# Altium schematic sheet [5] - Z7010 POWER INF.SchDoc: Z7010 POWER INF
size B; Organization: Altium Limited; Address1: L3, 12a Rodborough Rd; Address2: Frenchs Forest; Address3: NSW; Address4: Australia 2086; DocumentNumber: 5; SheetNumber: 5; SheetTotal: 16
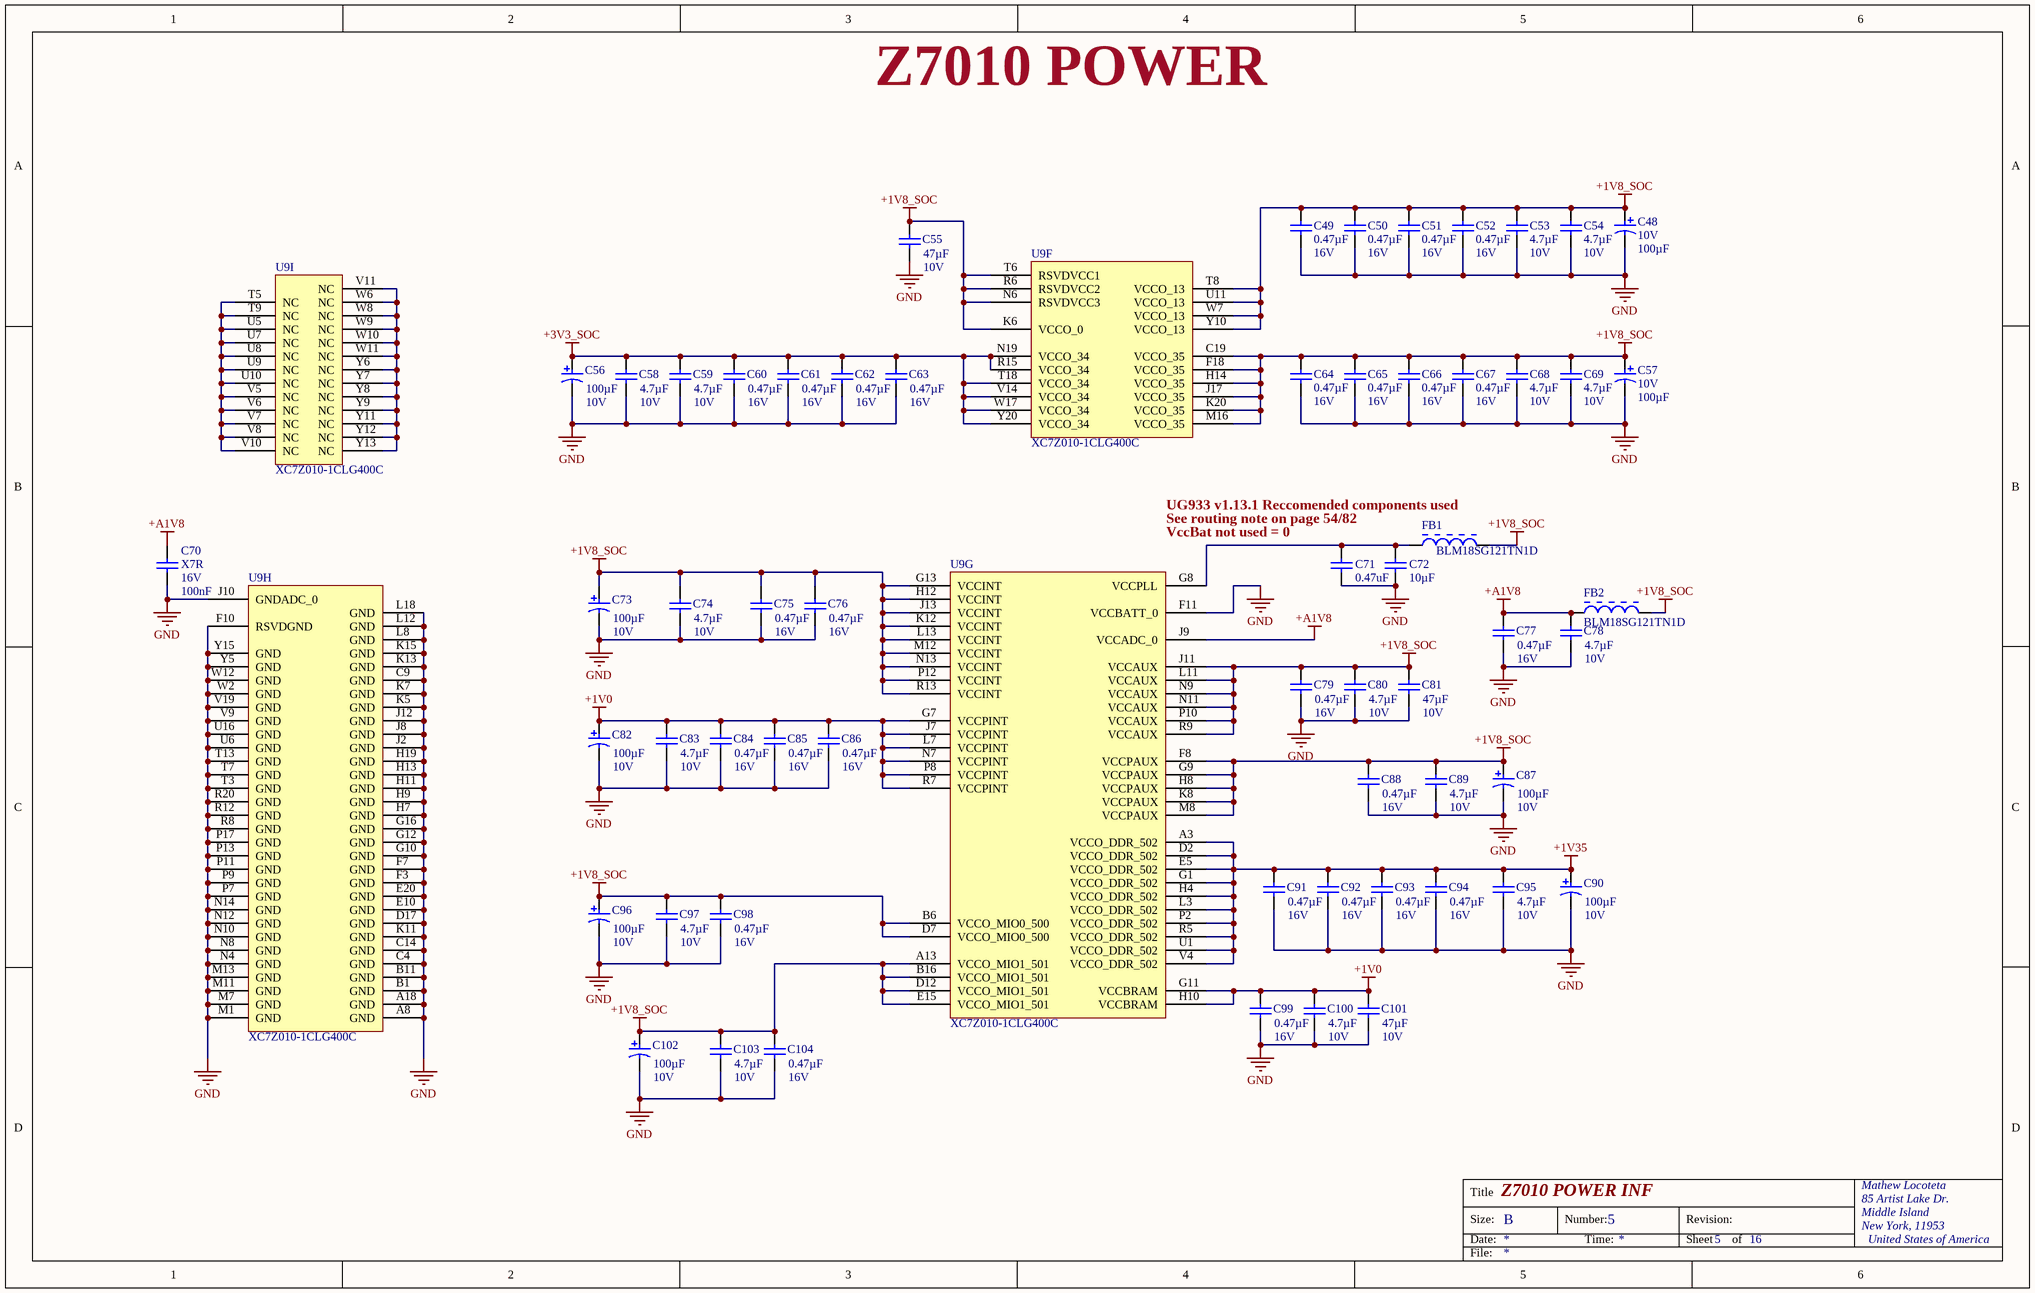
[diagram p0: [5] - Z7010 POWER INF.SchDoc]

## Parts
C48  Voltage: 10V  Capacitance: 100µF  [AVX-C2312_L]  (hidden comment: TPSC107K010R0075)
C49  value 0.47µF  Voltage: 16V  [CAPC1608X90X35NL10T15]  (hidden comment: GRM188R71C474KA88D)
C50  value 0.47µF  Voltage: 16V  [CAPC1608X90X35NL10T15]  (hidden comment: GRM188R71C474KA88D)
C51  value 0.47µF  Voltage: 16V  [CAPC1608X90X35NL10T15]  (hidden comment: GRM188R71C474KA88D)
C52  value 0.47µF  Voltage: 16V  [CAPC1608X90X35NL10T15]  (hidden comment: GRM188R71C474KA88D)
C53  value 4.7µF  Voltage: 10V  [CAPC2013X152X50ML20T25]  (hidden comment: 0805YC475KAT2A)
C54  value 4.7µF  Voltage: 10V  [CAPC2013X152X50ML20T25]  (hidden comment: 0805YC475KAT2A)
C55  Rated Voltage: 10V  Capacitance: 47µF  [MURA-1210_H_2.7_L]  (hidden comment: GRM32ER71A476ME15L)
C56  Voltage: 10V  Capacitance: 100µF  [AVX-C2312_L]  (hidden comment: TPSC107K010R0075)
C57  Voltage: 10V  Capacitance: 100µF  [AVX-C2312_L]  (hidden comment: TPSC107K010R0075)
C58  value 4.7µF  Voltage: 10V  [CAPC2013X152X50ML20T25]  (hidden comment: 0805YC475KAT2A)
C59  value 4.7µF  Voltage: 10V  [CAPC2013X152X50ML20T25]  (hidden comment: 0805YC475KAT2A)
C60  value 0.47µF  Voltage: 16V  [CAPC1608X90X35NL10T15]  (hidden comment: GRM188R71C474KA88D)
C61  value 0.47µF  Voltage: 16V  [CAPC1608X90X35NL10T15]  (hidden comment: GRM188R71C474KA88D)
C62  value 0.47µF  Voltage: 16V  [CAPC1608X90X35NL10T15]  (hidden comment: GRM188R71C474KA88D)
C63  value 0.47µF  Voltage: 16V  [CAPC1608X90X35NL10T15]  (hidden comment: GRM188R71C474KA88D)
C64  value 0.47µF  Voltage: 16V  [CAPC1608X90X35NL10T15]  (hidden comment: GRM188R71C474KA88D)
C65  value 0.47µF  Voltage: 16V  [CAPC1608X90X35NL10T15]  (hidden comment: GRM188R71C474KA88D)
C66  value 0.47µF  Voltage: 16V  [CAPC1608X90X35NL10T15]  (hidden comment: GRM188R71C474KA88D)
C67  value 0.47µF  Voltage: 16V  [CAPC1608X90X35NL10T15]  (hidden comment: GRM188R71C474KA88D)
C68  value 4.7µF  Voltage: 10V  [CAPC2013X152X50ML20T25]  (hidden comment: 0805YC475KAT2A)
C69  value 4.7µF  Voltage: 10V  [CAPC2013X152X50ML20T25]  (hidden comment: 0805YC475KAT2A)
C70  Dielectric: X7R  Voltage Rating: 16V  Capacitance: 100nF  (hidden comment: 100nF 0402 16V)
C71  value 0.47uF  [CAPC1005X55X25LL05T10]  (hidden comment: GRM155R60J474KE19D)
C72  value 10µF  [CAPC1608X90X35LL10T15]  (hidden comment: GRM188R60G106ME47D)
C73  Voltage: 10V  Capacitance: 100µF  [AVX-C2312_L]  (hidden comment: TPSC107K010R0075)
C74  value 4.7µF  Voltage: 10V  [CAPC2013X152X50ML20T25]  (hidden comment: 0805YC475KAT2A)
C75  value 0.47µF  Voltage: 16V  [CAPC1608X90X35NL10T15]  (hidden comment: GRM188R71C474KA88D)
C76  value 0.47µF  Voltage: 16V  [CAPC1608X90X35NL10T15]  (hidden comment: GRM188R71C474KA88D)
C77  value 0.47µF  Voltage: 16V  [CAPC1608X90X35NL10T15]  (hidden comment: GRM188R71C474KA88D)
C78  value 4.7µF  Voltage: 10V  [CAPC2013X152X50ML20T25]  (hidden comment: 0805YC475KAT2A)
C79  value 0.47µF  Voltage: 16V  [CAPC1608X90X35NL10T15]  (hidden comment: GRM188R71C474KA88D)
C80  value 4.7µF  Voltage: 10V  [CAPC2013X152X50ML20T25]  (hidden comment: 0805YC475KAT2A)
C81  Rated Voltage: 10V  Capacitance: 47µF  [MURA-1210_H_2.7_L]  (hidden comment: GRM32ER71A476ME15L)
C82  Voltage: 10V  Capacitance: 100µF  [AVX-C2312_L]  (hidden comment: TPSC107K010R0075)
C83  value 4.7µF  Voltage: 10V  [CAPC2013X152X50ML20T25]  (hidden comment: 0805YC475KAT2A)
C84  value 0.47µF  Voltage: 16V  [CAPC1608X90X35NL10T15]  (hidden comment: GRM188R71C474KA88D)
C85  value 0.47µF  Voltage: 16V  [CAPC1608X90X35NL10T15]  (hidden comment: GRM188R71C474KA88D)
C86  value 0.47µF  Voltage: 16V  [CAPC1608X90X35NL10T15]  (hidden comment: GRM188R71C474KA88D)
C87  Voltage: 10V  Capacitance: 100µF  [AVX-C2312_L]  (hidden comment: TPSC107K010R0075)
C88  value 0.47µF  Voltage: 16V  [CAPC1608X90X35NL10T15]  (hidden comment: GRM188R71C474KA88D)
C89  value 4.7µF  Voltage: 10V  [CAPC2013X152X50ML20T25]  (hidden comment: 0805YC475KAT2A)
C90  Voltage: 10V  Capacitance: 100µF  [AVX-C2312_L]  (hidden comment: TPSC107K010R0075)
C91  value 0.47µF  Voltage: 16V  [CAPC1608X90X35NL10T15]  (hidden comment: GRM188R71C474KA88D)
C92  value 0.47µF  Voltage: 16V  [CAPC1608X90X35NL10T15]  (hidden comment: GRM188R71C474KA88D)
C93  value 0.47µF  Voltage: 16V  [CAPC1608X90X35NL10T15]  (hidden comment: GRM188R71C474KA88D)
C94  value 0.47µF  Voltage: 16V  [CAPC1608X90X35NL10T15]  (hidden comment: GRM188R71C474KA88D)
C95  value 4.7µF  Voltage: 10V  [CAPC2013X152X50ML20T25]  (hidden comment: 0805YC475KAT2A)
C96  Voltage: 10V  Capacitance: 100µF  [AVX-C2312_L]  (hidden comment: TPSC107K010R0075)
C97  value 4.7µF  Voltage: 10V  [CAPC2013X152X50ML20T25]  (hidden comment: 0805YC475KAT2A)
C98  value 0.47µF  Voltage: 16V  [CAPC1608X90X35NL10T15]  (hidden comment: GRM188R71C474KA88D)
C99  value 0.47µF  Voltage: 16V  [CAPC1608X90X35NL10T15]  (hidden comment: GRM188R71C474KA88D)
C100  value 4.7µF  Voltage: 10V  [CAPC2013X152X50ML20T25]  (hidden comment: 0805YC475KAT2A)
C101  Rated Voltage: 10V  Capacitance: 47µF  [MURA-1210_H_2.7_L]  (hidden comment: GRM32ER71A476ME15L)
C102  Voltage: 10V  Capacitance: 100µF  [AVX-C2312_L]  (hidden comment: TPSC107K010R0075)
C103  value 4.7µF  Voltage: 10V  [CAPC2013X152X50ML20T25]  (hidden comment: 0805YC475KAT2A)
C104  value 0.47µF  Voltage: 16V  [CAPC1608X90X35NL10T15]  (hidden comment: GRM188R71C474KA88D)
FB1  BLM18SG121TN1D  [MURA-BLM18SG-B40-CHIP-2_V3]
FB2  BLM18SG121TN1D  [MURA-BLM18SG-B40-CHIP-2_V3]
U9  XC7Z010-1CLG400C  [CLG400]  (parts F,G,H,I of 9)

## Nets
+1V0: C82.1 C83.2 C84.2 C85.2 C86.2 C99.2 C100.2 C101.2 U9.G7(VCCPINT) U9.G11(VCCBRAM) U9.H10(VCCBRAM) U9.J7(VCCPINT) U9.L7(VCCPINT) U9.N7(VCCPINT) U9.P8(VCCPINT) U9.R7(VCCPINT)
+1V8_SOC: C48.1 C49.2 C50.2 C51.2 C52.2 C53.2 C54.2 C55.2 C57.1 C64.2 C65.2 C66.2 C67.2 C68.2 C69.2 C73.1 C74.2 C75.2 C76.2 C79.2 C80.2 C81.2 C87.1 C88.2 C89.2 C96.1 C97.2 C98.2 C102.1 C103.2 C104.2 FB1.2 FB2.2 U9.A13(VCCO_MIO1_501) U9.B6(VCCO_MIO0_500) U9.B16(VCCO_MIO1_501) U9.C19(VCCO_35) U9.D7(VCCO_MIO0_500) U9.D12(VCCO_MIO1_501) U9.E15(VCCO_MIO1_501) U9.F8(VCCPAUX) U9.F18(VCCO_35) U9.G9(VCCPAUX) U9.G13(VCCINT) U9.H8(VCCPAUX) U9.H12(VCCINT) U9.H14(VCCO_35) U9.J11(VCCAUX) U9.J13(VCCINT) U9.J17(VCCO_35) U9.K6(VCCO_0) U9.K8(VCCPAUX) U9.K12(VCCINT) U9.K20(VCCO_35) U9.L11(VCCAUX) U9.L13(VCCINT) U9.M8(VCCPAUX) U9.M12(VCCINT) U9.M16(VCCO_35) U9.N6(RSVDVCC3) U9.N9(VCCAUX) U9.N11(VCCAUX) U9.N13(VCCINT) U9.P10(VCCAUX) U9.P12(VCCINT) U9.R6(RSVDVCC2) U9.R9(VCCAUX) U9.R13(VCCINT) U9.T6(RSVDVCC1) U9.T8(VCCO_13) U9.U11(VCCO_13) U9.W7(VCCO_13) U9.Y10(VCCO_13)
+1V35: C90.1 C91.2 C92.2 C93.2 C94.2 C95.2 U9.A3(VCCO_DDR_502) U9.D2(VCCO_DDR_502) U9.E5(VCCO_DDR_502) U9.G1(VCCO_DDR_502) U9.H4(VCCO_DDR_502) U9.L3(VCCO_DDR_502) U9.P2(VCCO_DDR_502) U9.R5(VCCO_DDR_502) U9.U1(VCCO_DDR_502) U9.V4(VCCO_DDR_502)
+3V3_SOC: C56.1 C58.2 C59.2 C60.2 C61.2 C62.2 C63.2 U9.N19(VCCO_34) U9.R15(VCCO_34) U9.T18(VCCO_34) U9.V14(VCCO_34) U9.W17(VCCO_34) U9.Y20(VCCO_34)
+A1V8: C70.2 C77.2 C78.2 FB2.1 U9.J9(VCCADC_0)
GND: C48.2 C49.1 C50.1 C51.1 C52.1 C53.1 C54.1 C55.1 C56.2 C57.2 C58.1 C59.1 C60.1 C61.1 C62.1 C63.1 C64.1 C65.1 C66.1 C67.1 C68.1 C69.1 C70.1 C71.1 C72.1 C73.2 C74.1 C75.1 C76.1 C77.1 C78.1 C79.1 C80.1 C81.1 C82.2 C83.1 C84.1 C85.1 C86.1 C87.2 C88.1 C89.1 C90.2 C91.1 C92.1 C93.1 C94.1 C95.1 C96.2 C97.1 C98.1 C99.1 C100.1 C101.1 C102.2 C103.1 C104.1 U9.A8(GND) U9.A18(GND) U9.B1(GND) U9.B11(GND) U9.C4(GND) U9.C9(GND) U9.C14(GND) U9.D17(GND) U9.E10(GND) U9.E20(GND) U9.F3(GND) U9.F7(GND) U9.F10(RSVDGND) U9.F11(VCCBATT_0) U9.G10(GND) U9.G12(GND) U9.G16(GND) U9.H7(GND) U9.H9(GND) U9.H11(GND) U9.H13(GND) U9.H19(GND) U9.J2(GND) U9.J8(GND) U9.J10(GNDADC_0) U9.J12(GND) U9.K5(GND) U9.K7(GND) U9.K11(GND) U9.K13(GND) U9.K15(GND) U9.L8(GND) U9.L12(GND) U9.L18(GND) U9.M1(GND) U9.M7(GND) U9.M11(GND) U9.M13(GND) U9.N4(GND) U9.N8(GND) U9.N10(GND) U9.N12(GND) U9.N14(GND) U9.P7(GND) U9.P9(GND) U9.P11(GND) U9.P13(GND) U9.P17(GND) U9.R8(GND) U9.R12(GND) U9.R20(GND) U9.T3(GND) U9.T7(GND) U9.T13(GND) U9.U6(GND) U9.U16(GND) U9.V9(GND) U9.V19(GND) U9.W2(GND) U9.W12(GND) U9.Y5(GND) U9.Y15(GND)
NetC71_2: C71.2 C72.2 FB1.1 U9.G8(VCCPLL)
NetU9_T5: U9.T5(NC) U9.T9(NC) U9.U5(NC) U9.U7(NC) U9.U8(NC) U9.U9(NC) U9.U10(NC) U9.V5(NC) U9.V6(NC) U9.V7(NC) U9.V8(NC) U9.V10(NC)
NetU9_V11: U9.V11(NC) U9.W6(NC) U9.W8(NC) U9.W9(NC) U9.W10(NC) U9.W11(NC) U9.Y6(NC) U9.Y7(NC) U9.Y8(NC) U9.Y9(NC) U9.Y11(NC) U9.Y12(NC) U9.Y13(NC)

## Notes on the sheet
- Z7010 POWER
- UG933 v1.13.1 Reccomended components used
- See routing note on page 54/82
- VccBat not used = 0
- Title
- Size:
- Date:
- B
- Number:
- Time:
- Revision:
- Sheet
- of
- Mathew Locoteta
- 85 Artist Lake Dr.
- Middle Island
- New York, 11953
- United States of America
- File:

## Library data of the parts
C48 C56 C57 C73 C82 C87 C90 C96 C102 = CMP-2000-07293-1: TPS Series, Low ESR, 100 uF, +/- 10%, 10 V, -55 to 125 degC, 2-Pin SMD (2312), RoHS, Tape and Reel; Manufacturer: AVX; Product Depth (mm): 3.2mm; DCL: 10uA; Product Length (mm): 6mm; ESR: 0.075ohm; Product Height (mm): 2.6mm; Insulation: NotRequired; Product Diameter (mm): NotRequiredmm; Case Style: Molded; Rad Hardened: No; DF: 8%; Polarity: Polar; DELETED: Compliant; Manufacturer URL: http://www.avx.com/; Package Reference: C2312; Tolerance (+ or -): 10%; Datasheet Version: 01/2016; Package / Case: 6032-28; Construction: SMTChip; Failure Rate: NotRequired; Package Description: 2-Pin Surface Mount Device, Body 6 x 3.25 mm; Operating Temp Range: -55Cto125C; Packaging: TapeandReel; Seated Plane Height: NotRequiredmm; Case Code: C; Package URL: http://download.siliconexpert.com/pdfs/2016/2/7/1/56/13/306/avx_/manual/6tps.pdf; Length W/Weld (max): NotRequiredmm; Wire Form: NotRequired; Lead Spacing (nom): NotRequiredmm; Mounting Technology: SurfaceMount; Mounting Style: SurfaceMount; Datasheet URL: http://download.siliconexpert.com/pdfs/2016/2/7/1/56/13/306/avx_/manual/6tps.pdf; Length W/Weld: NotRequiredmm; Seal: NotRequired
C49-C52 C60-C67 C75-C77 C79 C84-C86 C88 C91-C94 C98 C99 C104 = CMP-2006-02860-1: Manufacturer: Murata; Part Number: GRM188R71C474KA88D
C53 C54 C58 C59 C68 C69 C74 C78 C80 C83 C89 C95 C97 C100 C103 = CMP-2007-04518-1: Manufacturer: AVX Interconnect / Elco; Part Number: 0805YC475KAT2A
C55 C81 C101 = CMP-2000-06363-1: Chip Capacitor, 47 uF, +/- 20%, 10 V, -55 to 125 degC, 1210 (3225 Metric), RoHS, Tape and Reel; Manufacturer: Murata; Dielectric: X7R; Datasheet Version: 01/2015; Case Size/Dimension: 1210; Mounting Technology: SurfaceMount; Datasheet URL: https://datasheet.ciiva.com/16624/product-16624240.pdf; Package Reference: 1210; Package Description: 2-Pin Surface Mount Device, Body 3.2 x 2.5 mm; Manufacturer URL: http://www.murata.com/; Tolerance (%): ±20%
C70 = C0402C104J4RACTU: KEMET - C0402C104J4RACTU - SMD Multilayer Ceramic Capacitor, 0.1 µF, 16 V, 0402 [1005 Metric], ± 5%, X7R, C Series KEMET; Dissipation Factor: 3.5%; Supplier 1: Digi-Key; Manufacturer: KEMET; Manufacturer Part Number: C0402C104J4RACTU; RoHS: Yes; Category: Ceramic Capacitors; Stock 1: 106350; Pricing 1: 1=0.48000, 10=0.33900, 50=0.25620, 100=0.22310, 500=0.16528, 1000=0.14049, 2500=0.13223, 5000=0.12396 (USD); Mount: Surface Mount,PCB; Case/Package: 0402; Case Code (Metric): 1005; Case Code (Imperial): 0402; Dielectric Material: Ceramic; Contact Plating: Tin,Matte; Min Operating Temperature: -55°C; Max Operating Temperature: 125°C; Tolerance: 5%; Packaging: Tape and Reel; Package Quantity: 1; Termination: SMD/SMT; Voltage: 16V; Length: 1mm; Height: 0.5mm; Width: 0.02inch; Thickness: 0.022inch; Depth: 0.5mm; Radiation Hardening: No; REACH SVHC: No SVHC; ComponentLink1URL: https://datasheet.ciiva.com/5415/kem-c1002-x7r-smd-5415819.pdf?src-supplier=Mouser; ComponentLink1Description: https://datasheet.ciiva.com/5415/kem-c1002-x7r-smd-5415819.pdf?src-supplier=Mouser; ComponentLink2URL: https://datasheet.ciiva.com/46424/1851736-46424159.pdf?src-supplier=Element14; ComponentLink2Description: https://datasheet.ciiva.com/46424/1851736-46424159.pdf?src-supplier=Element14; Supplier Part Number 1: 399-7761-1-ND; Voltage Rating (DC): 16V
C71 = CMP-2008-04548-1: Manufacturer: Murata; Part Number: GRM155R60J474KE19D
C72 = CMP-2006-02787-1: Manufacturer: Murata; Part Number: GRM188R60G106ME47D
FB1 FB2 = CMP-0686-00602-3: Chip Ferrite Bead for Power Lines (Low DC Resistance Type), 120 Ohm, 3000 mA, -55 to 125 degC, 1.6 x 0.8 x 0.65 mm SMD, Tape and Reel; Manufacturer: Murata; Impedance (at 100 MHz): 120 Ohm +/- 25%; Rated Current: 3000 mA; DC Resistance: 0.025 Ohm Max.; ComponentLink3Description: Package Specification; PackageReference: BLM18_H650-2; DatasheetVersion: 08/2013; Packing: Tape and Reel; PartNumber: BLM18SG121TN1D; PackageDescription: 2-Pin Chip, Body 1.6 x 0.8 mm; ComponentLink2Description: Datasheet; ComponentLink3URL: http://www.murata.com/products/catalog/pdf/c31e.pdf; ComponentLink1URL: http://www.murata.com/; Operating Temperature Range: -55 to 125 degC; Mounting Technology: Surface Mount; ComponentLink2URL: http://www.murata.com/products/catalog/pdf/c31e.pdf; ComponentLink1Description: Manufacturer URL
U9 = CMP-0363-00007-3: 667 MHz Zynq™-7000 AP SoC, 130 PS I/O, 100 FPGA I/O, 400-Ball BGA, Speed Grade 1, Commercial Grade, Pb-Free; Flip Flops: 35200; Speed Grade: -1; LUTs: 17600; Extensible Block RAM (# 36Kb Blocks): 240 KB (60); ComponentLink6Description: PCB and Layout Guide; ComponentLink3Description: DC and AC Switching Characteristics; ComponentLink2URL: http://www.xilinx.com/support/documentation/user_guides/ug865-Zynq-7000-Pkg-Pinout.pdf; PackageReference: CLG400; ComponentLink3URL: http://www.xilinx.com/support/documentation/data_sheets/ds187-XC7Z010-XC7Z020-Data-Sheet.pdf; DatasheetVersion: v1.2; Generic Part Number: XC7Z010; ComponentLink2Description: Package Specification; ComponentLink1Description: Datasheet; PartNumber: XC7Z010-1CLG400C; ComponentLink5Description: Packaging and Pinout; Code_JEDEC: MO-275-MMAA-1; RoHS: Pb-Free; ComponentLink5URL: http://www.xilinx.com/support/documentation/user_guides/ug865-Zynq-7000-Pkg-Pinout.pdf; ComponentLink1URL: http://www.xilinx.com/support/documentation/data_sheets/ds190-Zynq-7000-Overview.pdf; ComponentLink4Description: Package File; ComponentLink4URL: http://www.xilinx.com/support/packagefiles/z7packages/xc7z010clg400pkg.txt; PackageDescription: Wire-Bond Chip-Scale BGA, Body 17 x 17 mm, 0.8 mm Pitch; PackageVersion: Rev 1.1, 09/2012; Mounting Technology: Surface Mount; ComponentLink6URL: http://www.xilinx.com/support/documentation/user_guides/ug483_7Series_PCB.pdf